# EAGLE design LEDMatrix (EAGLE 6.6.0)
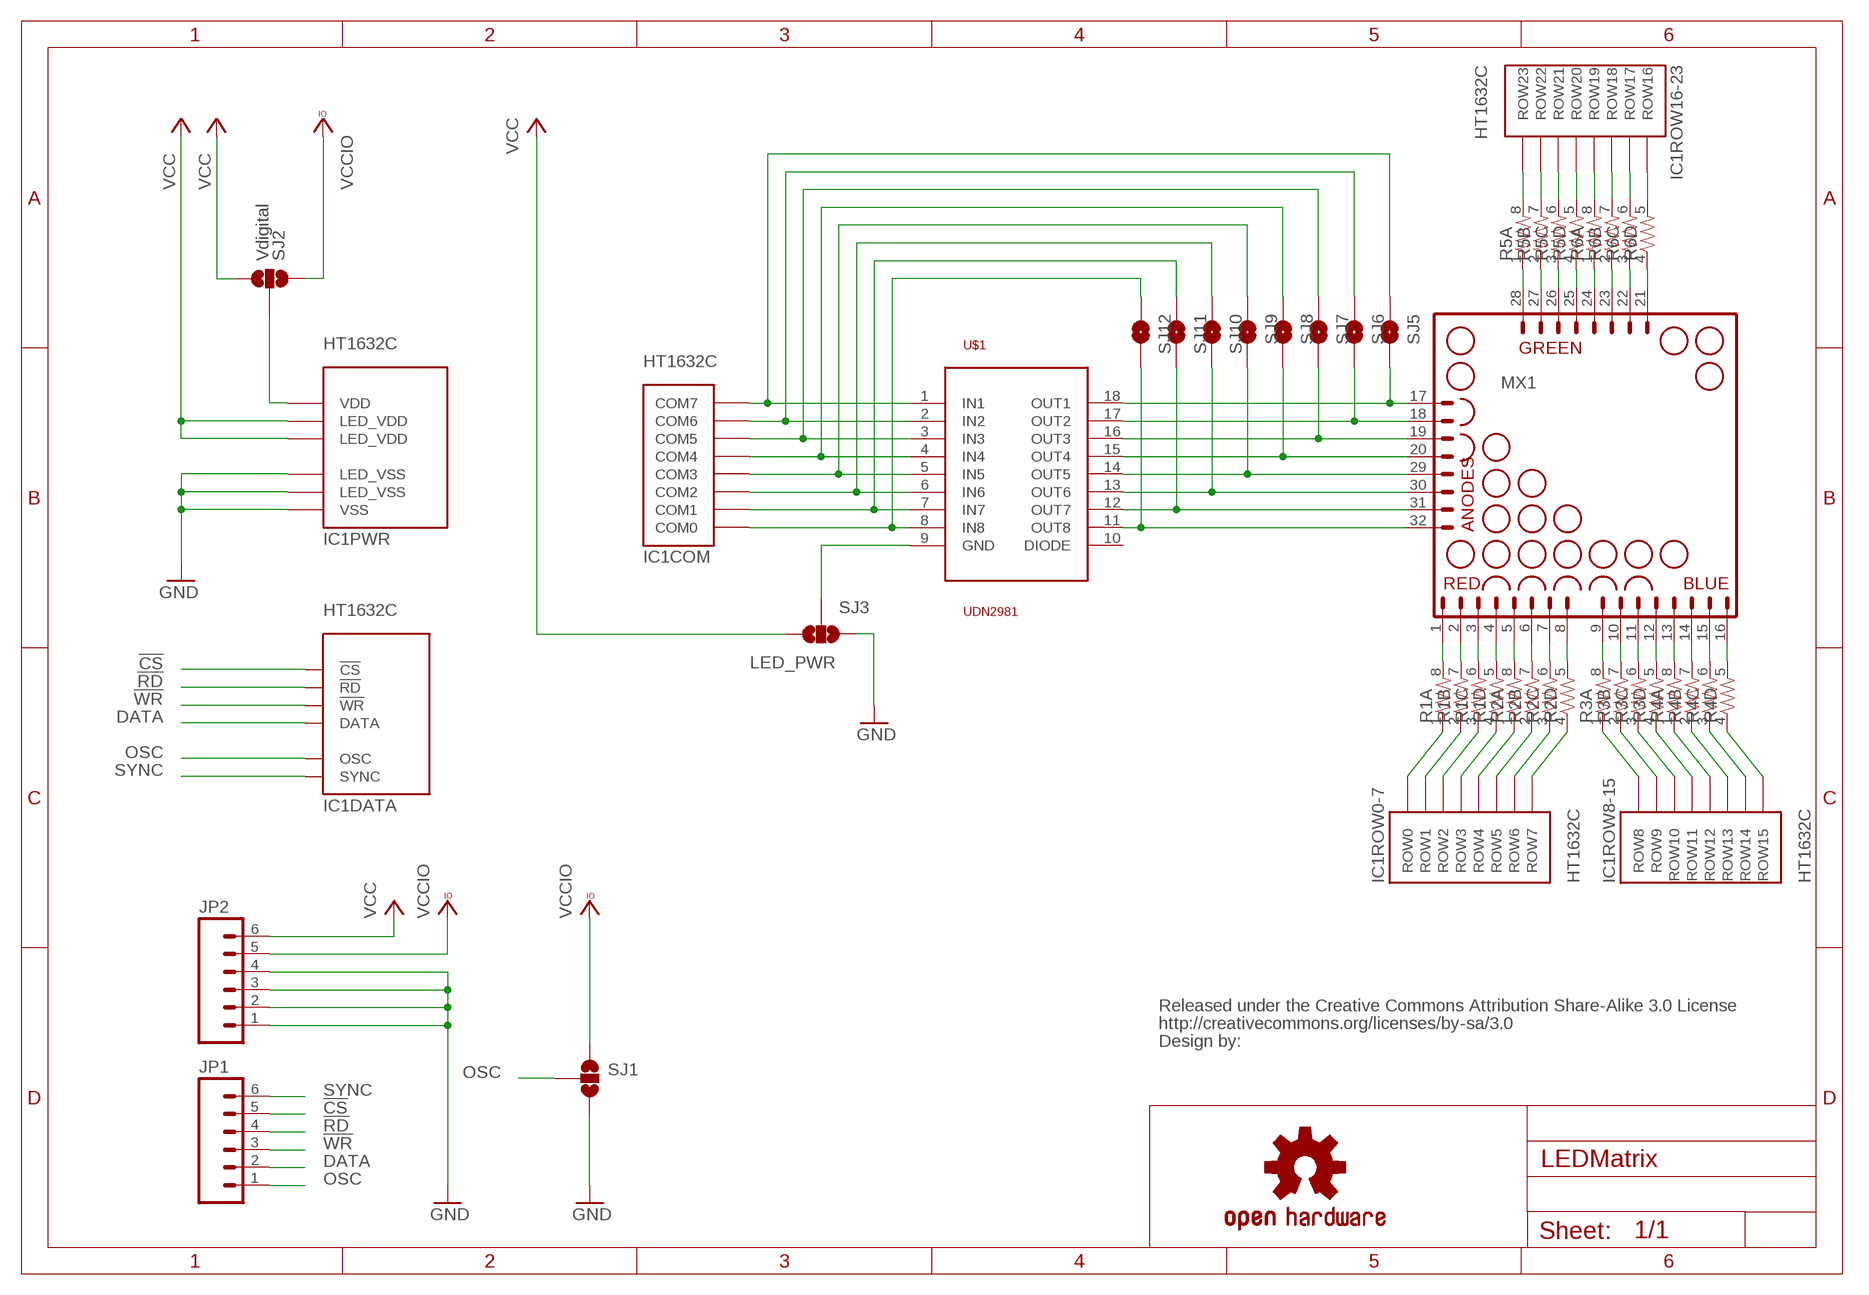
[diagram p0: schematic, sheet 1]

## Parts
CC_TEXT1  CREATIVE_COMMONS  [CREATIVE_COMMONS]
IC1  HT1632C  HT1632  [QFP52]
JP1  M06SIP  [1X06]
JP2  M06SIP  [1X06]
LOGO1  OSHW-LOGOL  [OSHW-LOGO-L]
MX1  MATRIX_8X8_TRICOLOR_ANODE_ROW  [MATRIX_60MM_32PIN]
R1  RESISTOR-ARRAY0603-ARV  [0603-ARV]
R2  RESISTOR-ARRAY0603-ARV  [0603-ARV]
R3  RESISTOR-ARRAY0603-ARV  [0603-ARV]
R4  RESISTOR-ARRAY0603-ARV  [0603-ARV]
R5  RESISTOR-ARRAY0603-ARV  [0603-ARV]
R6  RESISTOR-ARRAY0603-ARV  [0603-ARV]
SJ1  SOLDERJUMPER_2WAY-OLDS  [SJ_3]
SJ2  Vdigital  SOLDERJUMPER_2WAY-OLDS  [SJ_3]
SJ3  LED_PWR  SOLDERJUMPER_2WAY-OLDS  [SJ_3]
SJ5  SOLDERJUMPER-OLDNO  [SJ_2S-NO]
SJ6  SOLDERJUMPER-OLDNO  [SJ_2S-NO]
SJ7  SOLDERJUMPER-OLDNO  [SJ_2S-NO]
SJ8  SOLDERJUMPER-OLDNO  [SJ_2S-NO]
SJ9  SOLDERJUMPER-OLDNO  [SJ_2S-NO]
SJ10  SOLDERJUMPER-OLDNO  [SJ_2S-NO]
SJ11  SOLDERJUMPER-OLDNO  [SJ_2S-NO]
SJ12  SOLDERJUMPER-OLDNO  [SJ_2S-NO]
U$1  UDN2981  ULN2803  [SO18L]

## Nets
!CS: IC1.P$19(DATA:!CS) JP1.5
!RD: IC1.P$18(DATA:!RD) JP1.4
!WR: IC1.P$17(DATA:!WR) JP1.3
COM0: IC1.P$22(COM:COM0) SJ12.1 U$1.8(IN8)
COM1: IC1.P$23(COM:COM1) SJ11.1 U$1.7(IN7)
COM2: IC1.P$24(COM:COM2) SJ10.1 U$1.6(IN6)
COM3: IC1.P$26(COM:COM3) SJ9.1 U$1.5(IN5)
COM4: IC1.P$27(COM:COM4) SJ8.1 U$1.4(IN4)
COM5: IC1.P$28(COM:COM5) SJ7.1 U$1.3(IN3)
COM6: IC1.P$29(COM:COM6) SJ6.1 U$1.2(IN2)
COM7: IC1.P$30(COM:COM7) SJ5.1 U$1.1(IN1)
DATA: IC1.P$16(DATA:DATA) JP1.2
GND: IC1.P$14(PWR:VSS) IC1.P$25(PWR:LED_VSS) IC1.P$36(PWR:LED_VSS) JP2.1 JP2.2 JP2.3 JP2.4 SJ1.3 SJ3.1
N$1: MX1.32 SJ12.2 U$1.11(OUT8)
N$2: MX1.31 SJ11.2 U$1.12(OUT7)
N$3: MX1.30 SJ10.2 U$1.13(OUT6)
N$4: MX1.29 SJ9.2 U$1.14(OUT5)
N$5: MX1.20 SJ8.2 U$1.15(OUT4)
N$6: MX1.19 SJ7.2 U$1.16(OUT3)
N$7: MX1.18 SJ6.2 U$1.17(OUT2)
N$8: MX1.17 SJ5.2 U$1.18(OUT1)
N$9: IC1.P$21(PWR:VDD) SJ2.2
N$12: MX1.1 R1.8
N$13: MX1.2 R1.7
N$14: MX1.3 R1.6
N$15: MX1.4 R1.5
N$16: MX1.5 R2.8
N$17: MX1.6 R2.7
N$18: MX1.7 R2.6
N$19: MX1.8 R2.5
N$20: MX1.9 R3.8
N$21: MX1.10 R3.7
N$22: MX1.11 R3.6
N$23: MX1.12 R3.5
N$24: MX1.13 R4.8
N$25: MX1.14 R4.7
N$26: MX1.15 R4.6
N$27: MX1.16 R4.5
N$36: MX1.28 R5.1
N$37: MX1.27 R5.2
N$38: MX1.26 R5.3
N$39: MX1.25 R5.4
N$40: MX1.24 R6.1
N$41: MX1.23 R6.2
N$42: MX1.22 R6.3
N$43: MX1.21 R6.4
OSC: IC1.P$15(DATA:OSC) JP1.1 SJ1.2
ROW0: IC1.P$13(ROW0-7:ROW0) R1.1
ROW1: IC1.P$12(ROW0-7:ROW1) R1.2
ROW2: IC1.P$11(ROW0-7:ROW2) R1.3
ROW3: IC1.P$10(ROW0-7:ROW3) R1.4
ROW4: IC1.P$9(ROW0-7:ROW4) R2.1
ROW5: IC1.P$8(ROW0-7:ROW5) R2.2
ROW6: IC1.P$6(ROW0-7:ROW6) R2.3
ROW7: IC1.P$5(ROW0-7:ROW7) R2.4
ROW8: IC1.P$4(ROW8-15:ROW8) R3.1
ROW9: IC1.P$3(ROW8-15:ROW9) R3.2
ROW10: IC1.P$2(ROW8-15:ROW10) R3.3
ROW11: IC1.P$1(ROW8-15:ROW11) R3.4
ROW12: IC1.P$52(ROW8-15:ROW12) R4.1
ROW13: IC1.P$51(ROW8-15:ROW13) R4.2
ROW14: IC1.P$50(ROW8-15:ROW14) R4.3
ROW15: IC1.P$49(ROW8-15:ROW15) R4.4
ROW16: IC1.P$48(ROW16-23:ROW16) R6.5
ROW17: IC1.P$47(ROW16-23:ROW17) R6.6
ROW18: IC1.P$46(ROW16-23:ROW18) R6.7
ROW19: IC1.P$45(ROW16-23:ROW19) R6.8
ROW20: IC1.P$44(ROW16-23:ROW20) R5.5
ROW21: IC1.P$43(ROW16-23:ROW21) R5.6
ROW22: IC1.P$42(ROW16-23:ROW22) R5.7
ROW23: IC1.P$41(ROW16-23:ROW23) R5.8
SYNC: IC1.P$20(DATA:SYNC) JP1.6
VCC: IC1.P$7(PWR:LED_VDD) IC1.P$38(PWR:LED_VDD) JP2.6 SJ2.3 SJ3.3
VCCIO: JP2.5 SJ1.1 SJ2.1
VLED: SJ3.2 U$1.9(GND)
Unconnected: IC1.P$31(ROW24-31/COL8-15:ROW31) IC1.P$32(ROW24-31/COL8-15:ROW30) IC1.P$33(ROW24-31/COL8-15:ROW29) IC1.P$34(ROW24-31/COL8-15:ROW28) IC1.P$35(ROW24-31/COL8-15:ROW27) IC1.P$37(ROW24-31/COL8-15:ROW26) IC1.P$39(ROW24-31/COL8-15:ROW25) IC1.P$40(ROW24-31/COL8-15:ROW24) U$1.10(DIODE)

## Library data of the parts
CC_TEXT1 = SparkFun-Aesthetics:CREATIVE_COMMONS: Creative Commons License summary
IC1 = ht1632:HT1632
JP1 JP2 = SparkFun-Connectors:M06: Header 6 Standard 6-pin 0.1" header. Use with straight break away headers (SKU : PRT-00116), right angle break away headers (PRT-00553), swiss pins (PRT-00743), machine pins (PRT-00117), and female headers (PRT-00115). Molex polarized connector foot print use with SKU : PRT-08094 with associated crimp pins and housings. NOTES ON THE VARIANTS LOCK and LOCK_LONGPADS... This footprint was designed to help hold the alignment of a through-hole component (i.e. 6-pin header) while soldering it into place. You may notice that each hole has been shifted either up or down by 0.005 of an inch from it's more standard position (which is a perfectly straight line). This slight alteration caused the pins (the squares in the middle) to touch the edges of the holes. Because they are alternating, it causes a "brace" to hold the component in place. 0.005 has proven to be the perfect amount of "off-center" position when using our standard breakaway headers. Although looks a little odd when you look at the bare footprint, once you have a header in there, the alteration is very hard to notice. Also,if you push a header all the way into place, it is covered up entirely on the bottom side. This idea of altering the position of holes to aid alignment will be further integrated into the Sparkfun Library for other footprints. It can help hold any component with 3 or more connection pins.
LOGO1 = SparkFun-Aesthetics:OSHW-LOGO: Open Source Hardware Logo This logo indicates the piece of hardware it is found on incorporates a OSHW license and/or adheres to the definition of open source hardware found here: http://freedomdefined.org/OSHW
MX1 = matrix:MATRIX_8X8_TRICOLOR_ANODE_ROW: RGB 8x8 LED Matrix This variety of display has one anode pin for each row, and three cathode pins for each column. Each anode is shared by red, green and blue cathodes for each cell in the matrix. This part matches the matrix sold by LEDsee.com (SKU: RGBMATRIX) and Seeedstudio.com (SKU: LEDRGBMatrix). The datasheet lists the source as "Guoyexing Optoelectronics Co. Ltd.," part number GYXM-2388AURPGB.
R1-R6 = SparkFun-Passives:RESISTOR-ARRAY: Array Chip Resistor Source: RS Component / Phycomp
SJ1-SJ3 = SparkFun-Passives:SOLDERJUMPER_2WAY-OLD: Solder Jumper 2 way solder jumper
SJ5-SJ12 = SparkFun-Passives:SOLDERJUMPER-OLD: Solder Jumper Standard SMD solder jumper. Used to automate production. Two varients : Normally Open and Normally Closed are the same, but have different paste layers. NC will have a large amount of paste and should jumper during reflow.
U$1 = uln2803:ULN2803

## Board
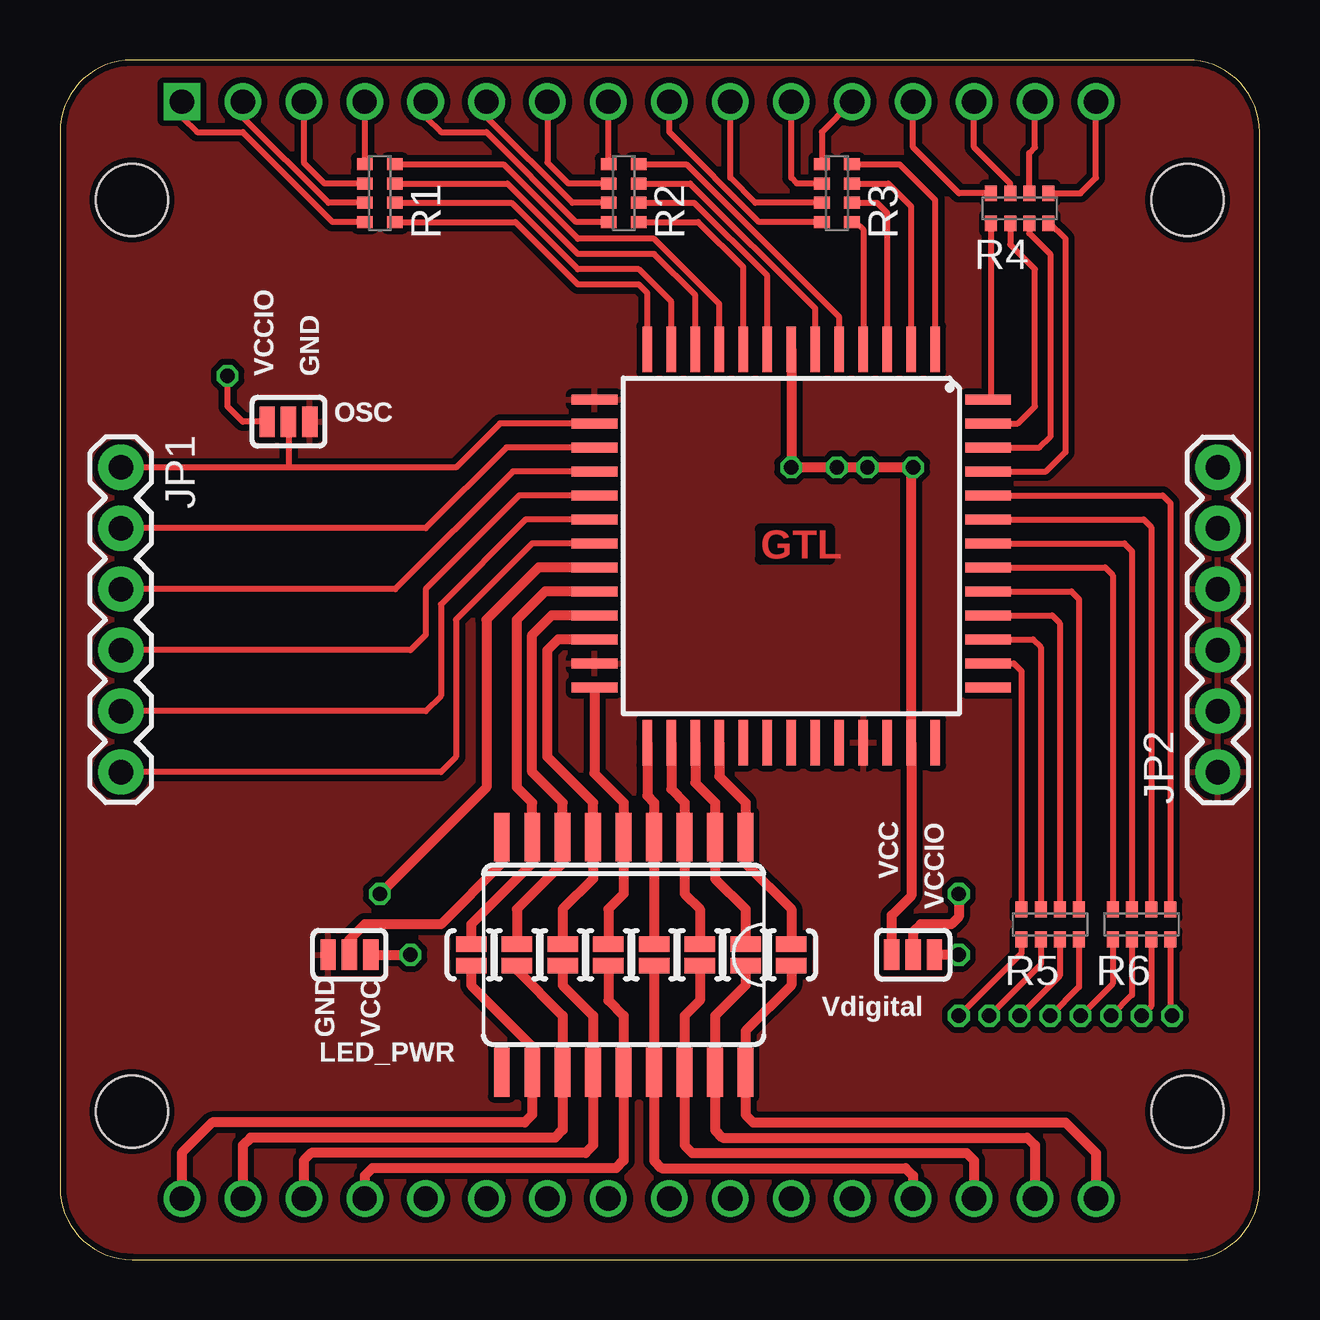
[diagram p1: board, top side]
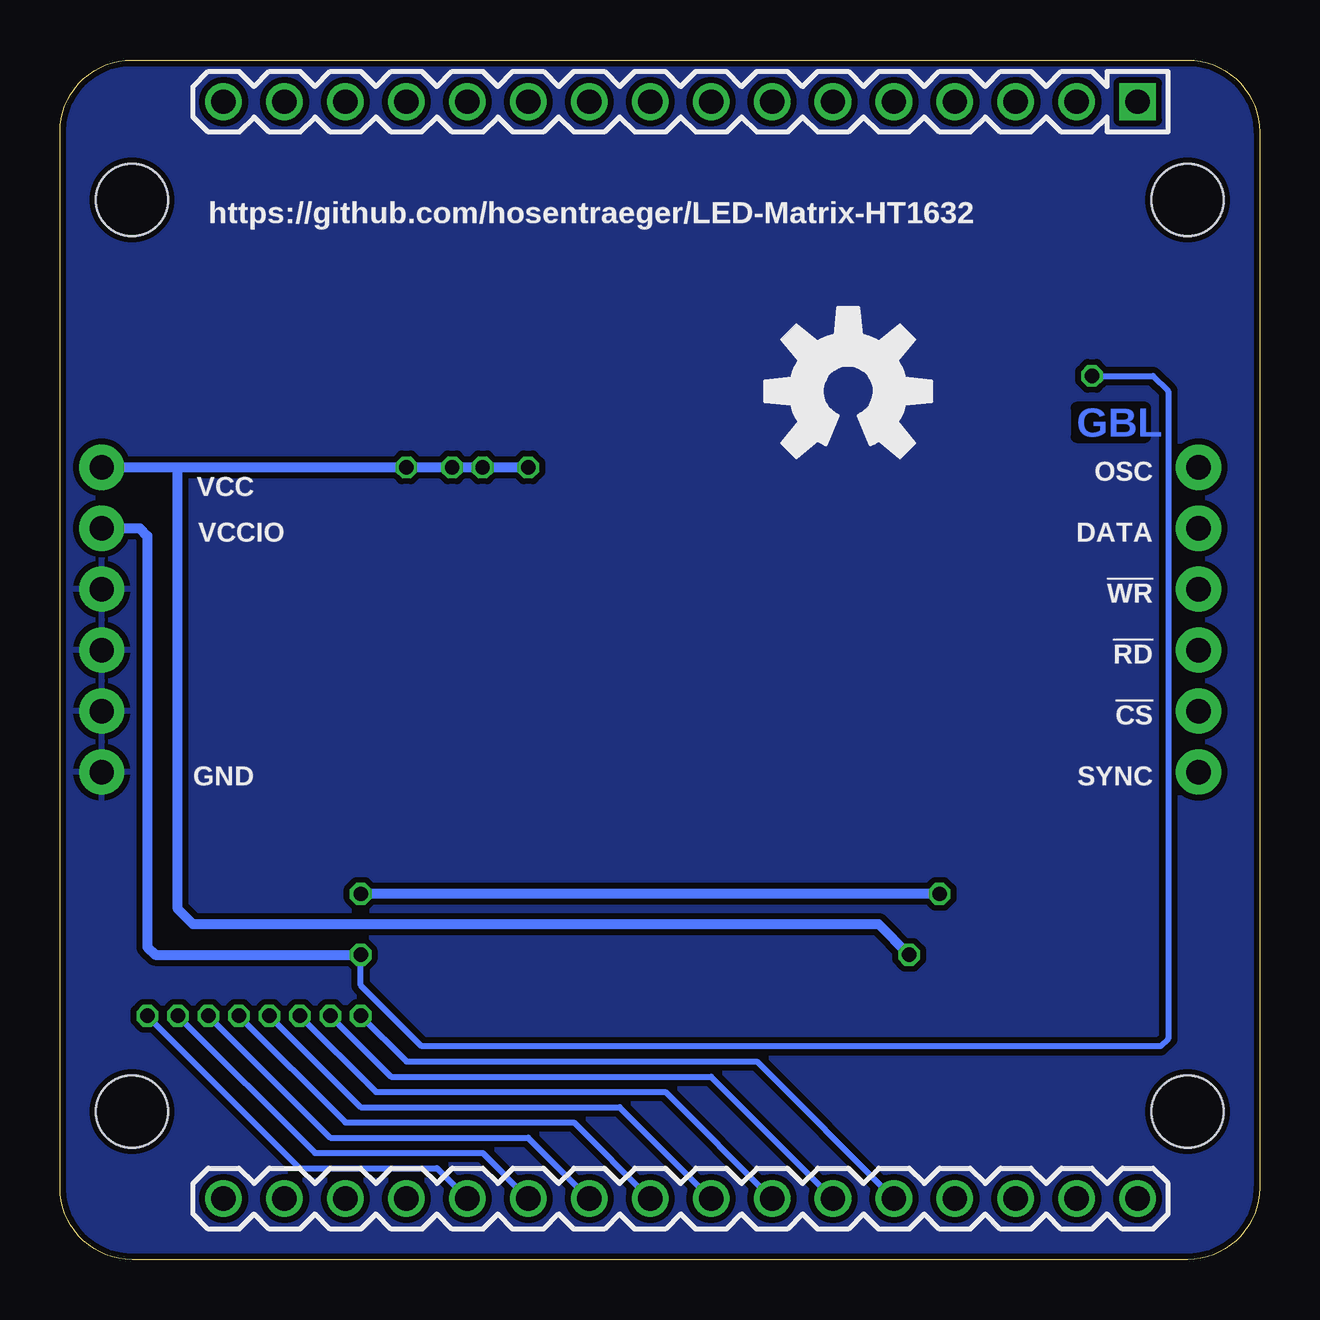
[diagram p2: board, bottom side, seen from below]

Size 50 x 50 mm. Coordinates in mm from the lower left corner, seen from the top.
Outline: 0,47 0,3 arc90 3,0 47,0 arc90 50,3 50,47 arc90 47,50 3,50 arc90 0,47
Copper layers (1*16): Top 0.035mm / dielectric 1.5mm / Bottom 0.035mm
Design rules "Elecrow_2-layer_eagle_rule": minimum track width 6mil, minimum drill 12mil, track to track 6mil, track to pad 6mil, pad to pad 6mil, via to via 6mil, smd to smd 0mil, copper to edge 10mil, drill to drill 10mil, minimum pad ring 10mil, minimum via ring 6mil, stop-mask expansion 2mil, vias tented up to drill 100mil, thermal gap 10mil
Holes 3 mm at 3,44.16 47,44.16 47,6.17 3,6.17

### Footprints (pad centres in the part's own frame; a part is rotated, then mirrored left to right if it is on the bottom)
QFP52 = smd 0.406 x 1.9: P$1 -6,-8.1; P$2 -5,-8.1; P$3 -4,-8.1; P$4 -3,-8.1; P$5 -2,-8.1; P$6 -1,-8.1; P$7 0,-8.1; P$8 1,-8.1; P$9 2,-8.1; P$10 3,-8.1; P$11 4,-8.1; P$12 5,-8.1; P$13 6,-8.1; P$27 6,8.3; P$28 5,8.3; P$29 4,8.3; P$30 3,8.3; P$31 2,8.3; P$32 1,8.3; P$33 0,8.3; P$34 -1,8.3; P$35 -2,8.3; P$36 -3,8.3; P$37 -4,8.3; P$38 -5,8.3; P$39 -6,8.3 | smd 1.9 x 0.406: P$14 8.2,-6; P$15 8.2,-5; P$16 8.2,-4; P$17 8.2,-3; P$18 8.2,-2; P$19 8.2,-1; P$20 8.2,0; P$21 8.2,1; P$22 8.2,2; P$23 8.2,3; P$24 8.2,4; P$25 8.2,5; P$26 8.2,6; P$40 -8.2,6; P$41 -8.2,5; P$42 -8.2,4; P$43 -8.2,3; P$44 -8.2,2; P$45 -8.2,1; P$46 -8.2,0; P$47 -8.2,-1; P$48 -8.2,-2; P$49 -8.2,-3; P$50 -8.2,-4; P$51 -8.2,-5; P$52 -8.2,-6
1X06 = drill 1.016 pad 1.88: 1 0,0; 2 2.54,0; 3 5.08,0; 4 7.62,0; 5 10.16,0; 6 12.7,0
MATRIX_60MM_32PIN = drill 1.016 square: 1 -19.05,-22.86 | drill 1.016: 2 -16.51,-22.86; 3 -13.97,-22.86; 4 -11.43,-22.86; 5 -8.89,-22.86; 6 -6.35,-22.86; 7 -3.81,-22.86; 8 -1.27,-22.86; 9 1.27,-22.86; 10 3.81,-22.86; 11 6.35,-22.86; 12 8.89,-22.86; 13 11.43,-22.86; 14 13.97,-22.86; 15 16.51,-22.86; 16 19.05,-22.86; 17 19.05,22.86; 18 16.51,22.86; 19 13.97,22.86; 20 11.43,22.86; 21 8.89,22.86; 22 6.35,22.86; 23 3.81,22.86; 24 1.27,22.86; 25 -1.27,22.86; 26 -3.81,22.86; 27 -6.35,22.86; 28 -8.89,22.86; 29 -11.43,22.86; 30 -13.97,22.86; 31 -16.51,22.86; 32 -19.05,22.86
0603-ARV = smd 0.5 x 0.65: 1 -1.2,-0.625; 2 -0.4,-0.625; 3 0.4,-0.625; 4 1.2,-0.625; 5 1.2,0.625; 6 0.4,0.625; 7 -0.4,0.625; 8 -1.2,0.625
SJ_3 = smd 0.635 x 1.27: 1 -0.889,0; 2 0,0; 3 0.889,0
SJ_2S-NO = smd 0.635 x 1.27: 1 -0.45,0; 2 0.45,0
SO18L = smd 0.66 x 2.032: 1 -5.08,-4.902; 2 -3.81,-4.902; 3 -2.54,-4.902; 4 -1.27,-4.902; 5 0,-4.902; 6 1.27,-4.902; 7 2.54,-4.902; 8 3.81,-4.902; 9 5.08,-4.902; 10 5.08,4.902; 11 3.81,4.902; 12 2.54,4.902; 13 1.27,4.902; 14 0,4.902; 15 -1.27,4.902; 16 -2.54,4.902; 17 -3.81,4.902; 18 -5.08,4.902

### Placement (x,y rotation side)
CC_TEXT1  20.32,-8.89 0 top  (outside the outline)
IC1  30.48,29.84 180 top
JP1  2.54,33.02 270 top
JP2  48.26,20.32 90 top
LOGO1  17.14,36.2 0 bottom
MX1  24.13,25.4 180 bottom
R1  13.34,44.45 90 top
R2  23.5,44.45 90 top
R3  32.38,44.45 90 top
R4  40.01,43.81 0 top
R5  41.27,13.97 0 top
R6  45.09,13.97 0 top
SJ1  9.53,34.92 0 top
SJ2  35.56,12.7 180 top
SJ3  12.06,12.7 0 top
SJ5  30.48,12.7 270 top
SJ6  28.57,12.7 270 top
SJ7  26.67,12.7 270 top
SJ8  24.77,12.7 270 top
SJ9  22.86,12.7 270 top
SJ10  20.95,12.7 270 top
SJ11  19.05,12.7 270 top
SJ12  17.14,12.7 270 top
U$1  23.5,12.7 180 top

### Tracks (layer width: path | path; a pad name or v marks a point on that pad's centre or on a via)
!CS
  Top 0.254: IC1.P$19 19.41,30.84 15.88,27.3 15.88,23.5 15.24,22.86 JP1.5
!RD
  Top 0.254: IC1.P$18 19.14,31.84 15.24,27.94 15.24,26.04 14.61,25.4 JP1.4
!WR
  Top 0.254: IC1.P$17 18.88,32.84 13.97,27.94 JP1.3
COM0
  Top 0.406: IC1.P$22 20.23,27.84 19.05,26.67 19.05,19.68 19.68,19.05 U$1.8 19.68,16.51 17.14,13.97 SJ12.1
COM1
  Top 0.406: IC1.P$23 20.5,26.84 19.68,26.04 19.68,20.32 20.95,19.05 U$1.7 20.95,16.51 19.05,14.61 SJ11.1
COM2
  Top 0.406: IC1.P$24 20.77,25.84 20.32,25.4 20.32,20.95 22.23,19.05 U$1.6 22.23,15.88 20.95,14.61 SJ10.1
COM3
  Top 0.406: IC1.P$26 22.28,20.27 23.5,19.05 U$1.5 23.5,15.24 22.86,14.61 SJ9.1
COM4
  Top 0.406: IC1.P$27 24.48,19.34 24.77,19.05 U$1.4 SJ8.1
COM5
  Top 0.406: IC1.P$28 25.48,19.61 26.04,19.05 U$1.3 26.04,15.24 26.67,14.61 SJ7.1
COM6
  Top 0.406: IC1.P$29 26.48,19.88 27.3,19.05 U$1.2 27.3,15.88 28.57,14.61 SJ6.1
COM7
  Top 0.406: IC1.P$30 27.48,20.14 28.57,19.05 U$1.1 28.57,16.51 30.48,14.61 SJ5.1
DATA
  Top 0.254: IC1.P$16 18.61,33.84 15.24,30.48 JP1.2
GND
  pour Top (isolate 0.254): 0,50.16 50,50.16 50,0.17 0,0.17
  pour Bottom (isolate 0.254): 0,50.16 50,50.16 50,0.17 0,0.17
N$1
  Top 0.406: MX1.32 5.08,4.45 6.35,5.71 19.37,5.71 19.68,6.03 U$1.11 19.68,8.89 17.14,11.43 SJ12.2
N$2
  Top 0.406: MX1.31 7.62,4.76 7.94,5.08 20.64,5.08 20.95,5.4 U$1.12 20.95,10.16 19.05,12.06 SJ11.2
N$3
  Top 0.406: MX1.30 10.16,4.13 10.48,4.45 21.91,4.45 22.23,4.76 U$1.13 22.23,10.16 20.95,11.43 SJ10.2
N$4
  Top 0.406: MX1.29 12.7,3.49 13.02,3.81 23.18,3.81 23.5,4.13 U$1.14 23.5,10.16 22.86,10.79 SJ9.2
N$5
  Top 0.406: MX1.20 35.56,3.49 35.24,3.81 25.08,3.81 24.77,4.13 U$1.15 SJ8.2
N$6
  Top 0.406: MX1.19 38.1,4.13 37.78,4.45 26.35,4.45 26.04,4.76 U$1.16 26.04,10.16 26.67,10.79 SJ7.2
N$7
  Top 0.406: MX1.18 40.64,4.76 40.32,5.08 27.62,5.08 27.3,5.4 U$1.17 27.3,10.16 28.57,11.43 SJ6.2
N$8
  Top 0.406: MX1.17 43.18,4.45 41.91,5.71 28.89,5.71 28.57,6.03 U$1.18 28.57,9.53 30.48,11.43 SJ5.2
N$9  (via drill 0.6)
  Top 0.406: v37.47,15.24 37.47,14.29 37.15,13.97 35.88,13.97 35.56,13.65 SJ2.2 | IC1.P$21 19.95,28.84 17.78,26.67 17.78,19.68 v13.34,15.24
  Bottom 0.406: v13.34,15.24 v37.47,15.24
N$12
  Top 0.254: R1.8 11.36,43.25 7.62,46.99 5.71,46.99 5.08,47.62 MX1.1
N$13
  Top 0.254: R1.7 11.2,44.05 7.62,47.62 MX1.2
N$14
  Top 0.254: R1.6 11.03,44.85 10.16,45.72 MX1.3
N$15
  Top 0.254: R1.5 MX1.4
N$16
  Top 0.254: R2.8 21.52,43.25 17.78,46.99 15.88,46.99 15.24,47.62 MX1.5
N$17
  Top 0.254: R2.7 21.36,44.05 17.78,47.62 MX1.6
N$18
  Top 0.254: R2.6 21.19,44.85 20.32,45.72 MX1.7
N$19
  Top 0.254: R2.5 MX1.8
N$20
  Top 0.254: R3.8 29.14,43.25 25.4,46.99 MX1.9
N$21
  Top 0.254: R3.7 28.98,44.05 27.94,45.09 MX1.10
N$22
  Top 0.254: R3.6 30.71,44.85 30.48,45.09 MX1.11
N$23
  Top 0.254: MX1.12 31.76,47 R3.5
N$24
  Top 0.254: R4.8 37.48,44.44 35.56,46.35 MX1.13
N$25
  Top 0.254: R4.7 39.6,44.85 38.1,46.35 MX1.14
N$26
  Top 0.254: R4.6 40.41,46.12 40.64,46.35 MX1.15
N$27
  Top 0.254: R4.5 42.53,44.44 43.18,45.09 MX1.16
N$36  (via drill 0.6)
  Top 0.254: R5.1 40.08,12.77 v37.47,10.16
  Bottom 0.254: v37.47,10.16 35.56,8.26 20.95,8.26 MX1.28
N$37  (via drill 0.6)
  Top 0.254: R5.2 40.88,12.3 v38.73,10.16
  Bottom 0.254: v38.73,10.16 36.2,7.62 22.86,7.62 MX1.27
N$38  (via drill 0.6)
  Top 0.254: R5.3 41.67,11.83 v40.01,10.16
  Bottom 0.254: v40.01,10.16 36.83,6.99 24.77,6.99 MX1.26
N$39  (via drill 0.6)
  Top 0.254: R5.4 42.48,11.36 v41.27,10.16
  Bottom 0.254: v41.27,10.16 37.47,6.35 26.67,6.35 MX1.25
N$40  (via drill 0.6)
  Top 0.254: R6.1 43.88,11.5 v42.55,10.16
  Bottom 0.254: v42.55,10.16 38.1,5.71 28.57,5.71 MX1.24
N$41  (via drill 0.6)
  Top 0.254: R6.2 44.69,11.03 v43.81,10.16
  Bottom 0.254: v43.81,10.16 38.73,5.08 30.48,5.08 MX1.23
N$42  (via drill 0.6)
  Top 0.254: R6.3 45.48,10.56 v45.09,10.16
  Bottom 0.254: v45.09,10.16 39.37,4.45 32.38,4.45 MX1.22
N$43  (via drill 0.6)
  Top 0.254: R6.4 46.28,10.23 v46.35,10.16
  Bottom 0.254: v46.35,10.16 40.01,3.81 34.29,3.81 MX1.21
OSC
  Top 0.254: IC1.P$15 18.34,34.84 16.51,33.02 9.53,33.02 | 9.53,33.02 JP1.1 | SJ1.2 9.53,33.02
ROW0
  Top 0.254: R1.1 18.98,43.25 21.59,40.64 24.13,40.64 24.48,40.29 IC1.P$13
ROW1
  Top 0.254: R1.2 18.82,44.05 21.59,41.27 24.13,41.27 25.48,39.92 IC1.P$12
ROW2
  Top 0.254: R1.3 18.65,44.85 21.59,41.91 24.77,41.91 26.48,40.2 IC1.P$11
ROW3
  Top 0.254: R1.4 18.48,45.65 21.59,42.55 24.77,42.55 27.48,39.83 IC1.P$10
ROW4
  Top 0.254: R2.1 26.6,43.25 28.48,41.37 IC1.P$9
ROW5
  Top 0.254: R2.2 26.43,44.05 29.48,41.01 IC1.P$8
ROW6
  Top 0.254: R2.3 26.27,44.85 31.48,39.64 IC1.P$6
ROW7
  Top 0.254: R2.4 26.11,45.65 32.48,39.27 IC1.P$5
ROW8
  Top 0.254: R3.1 33.16,43.25 33.48,42.93 IC1.P$4
ROW9
  Top 0.254: R3.2 34.05,44.05 34.48,43.62 IC1.P$3
ROW10
  Top 0.254: R3.3 34.52,44.85 35.48,43.9 IC1.P$2
ROW11
  Top 0.254: R3.4 34.99,45.65 36.48,44.16 IC1.P$1
ROW12
  Top 0.254: R4.1 38.8,35.97 IC1.P$52
ROW13
  Top 0.254: R4.2 39.6,42.31 40.64,41.27 40.64,35.56 39.92,34.84 IC1.P$51
ROW14
  Top 0.254: R4.3 40.41,42.78 41.27,41.91 41.27,34.29 40.83,33.84 IC1.P$50
ROW15
  Top 0.254: R4.4 41.2,43.25 41.91,42.55 41.91,33.66 41.1,32.84 IC1.P$49
ROW16
  Top 0.254: IC1.P$48 45.97,31.84 46.28,31.53 R6.5
ROW17
  Top 0.254: IC1.P$47 45.17,30.84 45.48,30.53 R6.6
ROW18
  Top 0.254: IC1.P$46 44.37,29.84 44.69,29.53 R6.7
ROW19
  Top 0.254: IC1.P$45 43.57,28.84 43.88,28.53 R6.8
ROW20
  Top 0.254: IC1.P$44 42.16,27.84 42.48,27.53 R5.5
ROW21
  Top 0.254: IC1.P$43 41.36,26.84 41.67,26.53 R5.6
ROW22
  Top 0.254: IC1.P$42 40.56,25.84 40.88,25.53 R5.7
ROW23
  Top 0.254: IC1.P$41 39.76,24.84 40.08,24.53 R5.8
SYNC
  Top 0.254: IC1.P$20 19.68,29.84 16.51,26.67 16.51,20.95 15.88,20.32 JP1.6
VCC  (via drill 0.6)
  Top 0.406: IC1.P$7 v30.48,33.02 v32.38,33.02 v33.66,33.02 v35.56,33.02 35.48,32.94 IC1.P$38 35.48,15.16 34.67,14.35 SJ2.3 | SJ3.3 v14.61,12.7
  Bottom 0.406: v30.48,33.02 v32.38,33.02 v33.66,33.02 v35.56,33.02 | v35.56,33.02 45.09,33.02 | 45.09,33.02 JP2.6 | 35.48,32.94 v35.56,33.02 | v14.61,12.7 15.88,13.97 44.45,13.97 45.09,14.61 45.09,33.02
VCCIO  (via drill 0.6)
  Top 0.254: SJ1.1 7.62,34.92 6.99,35.56 v6.99,36.83
  Top 0.406: v37.47,12.7 SJ2.1
  Bottom 0.254: v6.99,36.83 4.45,36.83 3.81,36.2 3.81,9.21 4.13,8.89 34.92,8.89 37.47,11.43 v37.47,12.7
  Bottom 0.406: JP2.5 46.67,30.48 46.35,30.16 46.35,13.02 46.04,12.7 v37.47,12.7
VLED
  Top 0.406: U$1.9 18.41,16.51 15.88,13.97 12.7,13.97 12.06,13.34 SJ3.2

### Text on the board
Top: GTL
Bottom: GBL
tPlace: VCCIO | GND | OSC | VCC | VCCIO | GND | VCC
bPlace: https://github.com/hosentraeger/LED-Matrix-HT1632 | OSC | VCC | DATA | VCCIO | !WR | !RD | !CS | SYNC | GND
_tsilk: VCCIO | GND | OSC | VCC | VCCIO | Vdigital | GND | VCC | LED_PWR
_bsilk: https://github.com/hosentraeger/LED-Matrix-HT1632 | OSC | VCC | DATA | VCCIO | !WR | !RD | !CS | SYNC | GND